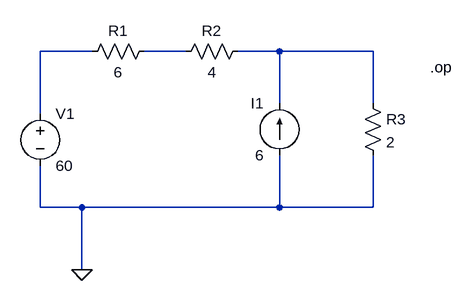
[diagram p0: schematic Draft5.asc]
Draft5.asc, the LTspice schematic file:
Version 4
SHEET 1 880 680
WIRE 240 176 160 176
WIRE 384 176 320 176
WIRE 528 176 464 176
WIRE 672 176 528 176
WIRE 528 256 528 176
WIRE 672 256 672 176
WIRE 160 272 160 176
WIRE 160 416 160 352
WIRE 224 416 160 416
WIRE 528 416 528 336
WIRE 528 416 224 416
WIRE 672 416 672 336
WIRE 672 416 528 416
WIRE 224 512 224 416
FLAG 224 512 0
SYMBOL voltage 160 256 R0
SYMATTR InstName V1
SYMATTR Value 60
SYMBOL res 336 160 R90
WINDOW 0 0 56 VBottom 2
WINDOW 3 32 56 VTop 2
SYMATTR InstName R1
SYMATTR Value 6
SYMBOL res 480 160 R90
WINDOW 0 0 56 VBottom 2
WINDOW 3 32 56 VTop 2
SYMATTR InstName R2
SYMATTR Value 4
SYMBOL current 528 336 R180
WINDOW 0 24 80 Left 2
WINDOW 3 24 0 Left 2
SYMATTR InstName I1
SYMATTR Value 6
SYMBOL res 656 240 R0
SYMATTR InstName R3
SYMATTR Value 2
TEXT 760 200 Left 2 !.op

The netlist it stands for:
* Draft5.asc
V1 N001 0 60
R1 N002 N001 6
R2 N003 N002 4
I1 0 N003 6
R3 N003 0 2
.op
.backanno
.end